# Altium schematic sheet IDC_MCX_Adapter_Front.SchDoc: IDC MCX adapter
size 420 x 297 mm; EDA_Number: ARTIQ; Projet: Fastino; Author: G.Kasprowicz; CompanyName: WUT ISE; DrawnBy: G.Kasprowicz; Organization: WUT ISE; Address1: PW ISE; Address2: Nowowiejska 15/19 00-665 Warsaw; Address3: gkasprow@gmail.com; DocumentNumber: 1; Revision: 2; SheetNumber: 1; SheetTotal: 3; ModifiedBy: -; CheckedDate: -; Title2: front panel; DivGrp: WUT ISE; Designer: G.Kasprowicz; ModifiedDate: -; ProjectName: Sensor Box
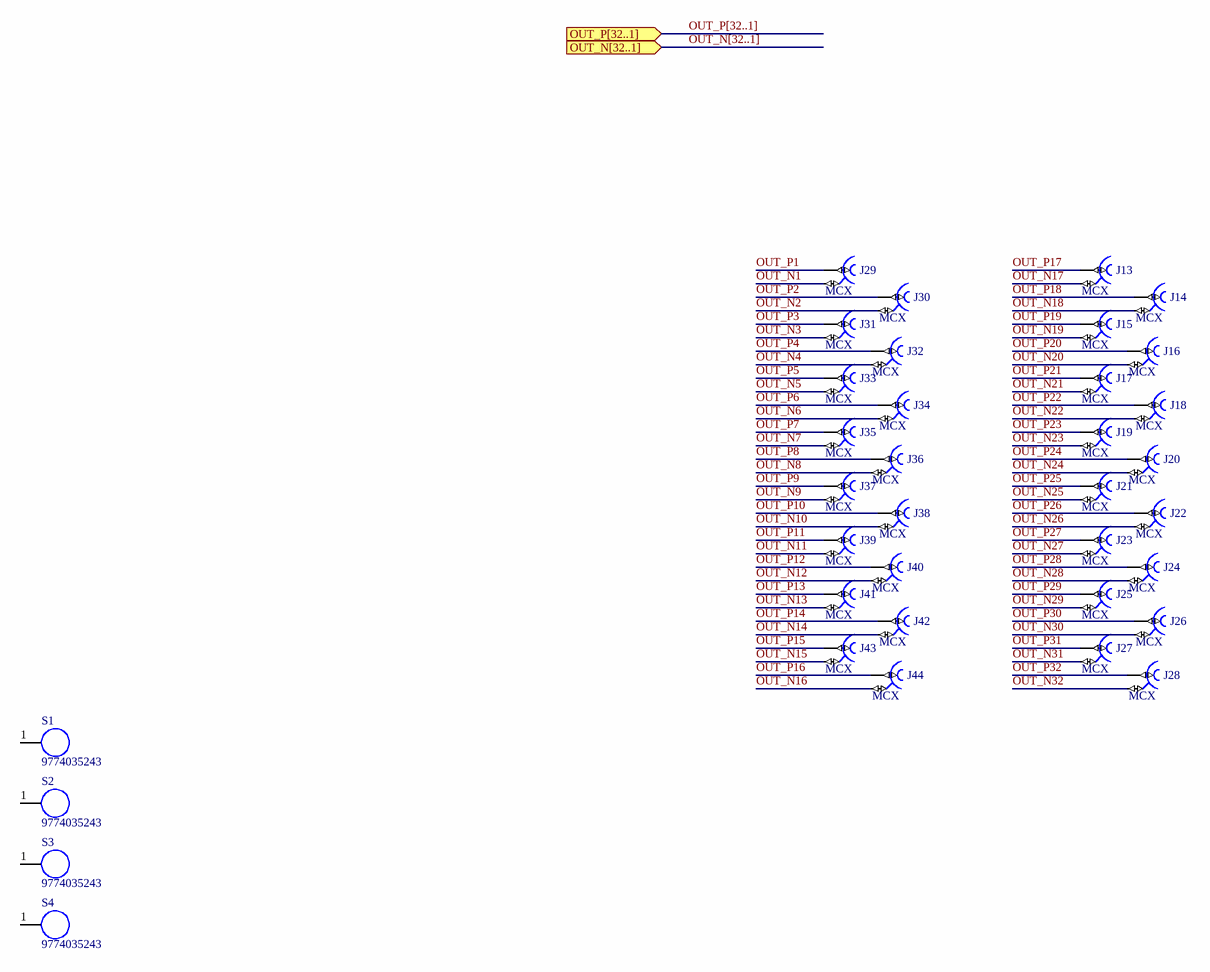
[diagram p0: IDC_MCX_Adapter_Front.SchDoc]

## Parts
J13  MCX  [AMPHENOL_919-109J-51PX]
J14  MCX  [AMPHENOL_919-109J-51PX]
J15  MCX  [AMPHENOL_919-109J-51PX]
J16  MCX  [AMPHENOL_919-109J-51PX]
J17  MCX  [AMPHENOL_919-109J-51PX]
J18  MCX  [AMPHENOL_919-109J-51PX]
J19  MCX  [AMPHENOL_919-109J-51PX]
J20  MCX  [AMPHENOL_919-109J-51PX]
J21  MCX  [AMPHENOL_919-109J-51PX]
J22  MCX  [AMPHENOL_919-109J-51PX]
J23  MCX  [AMPHENOL_919-109J-51PX]
J24  MCX  [AMPHENOL_919-109J-51PX]
J25  MCX  [AMPHENOL_919-109J-51PX]
J26  MCX  [AMPHENOL_919-109J-51PX]
J27  MCX  [AMPHENOL_919-109J-51PX]
J28  MCX  [AMPHENOL_919-109J-51PX]
J29  MCX  [AMPHENOL_919-109J-51PX]
J30  MCX  [AMPHENOL_919-109J-51PX]
J31  MCX  [AMPHENOL_919-109J-51PX]
J32  MCX  [AMPHENOL_919-109J-51PX]
J33  MCX  [AMPHENOL_919-109J-51PX]
J34  MCX  [AMPHENOL_919-109J-51PX]
J35  MCX  [AMPHENOL_919-109J-51PX]
J36  MCX  [AMPHENOL_919-109J-51PX]
J37  MCX  [AMPHENOL_919-109J-51PX]
J38  MCX  [AMPHENOL_919-109J-51PX]
J39  MCX  [AMPHENOL_919-109J-51PX]
J40  MCX  [AMPHENOL_919-109J-51PX]
J41  MCX  [AMPHENOL_919-109J-51PX]
J42  MCX  [AMPHENOL_919-109J-51PX]
J43  MCX  [AMPHENOL_919-109J-51PX]
J44  MCX  [AMPHENOL_919-109J-51PX]
S1  9774035243  [9774035243]
S2  9774035243  [9774035243]
S3  9774035243  [9774035243]
S4  9774035243  [9774035243]

## Ports
OUT_N[32..1] (in), OUT_P[32..1] (in)

## Nets
OUT_N1: J29.2
OUT_N2: J30.2
OUT_N3: J31.2
OUT_N4: J32.2
OUT_N5: J33.2
OUT_N6: J34.2
OUT_N7: J35.2
OUT_N8: J36.2
OUT_N9: J37.2
OUT_N10: J38.2
OUT_N11: J39.2
OUT_N12: J40.2
OUT_N13: J41.2
OUT_N14: J42.2
OUT_N15: J43.2
OUT_N16: J44.2
OUT_N17: J13.2
OUT_N18: J14.2
OUT_N19: J15.2
OUT_N20: J16.2
OUT_N21: J17.2
OUT_N22: J18.2
OUT_N23: J19.2
OUT_N24: J20.2
OUT_N25: J21.2
OUT_N26: J22.2
OUT_N27: J23.2
OUT_N28: J24.2
OUT_N29: J25.2
OUT_N30: J26.2
OUT_N31: J27.2
OUT_N32: J28.2
OUT_P1: J29.1
OUT_P2: J30.1
OUT_P3: J31.1
OUT_P4: J32.1
OUT_P5: J33.1
OUT_P6: J34.1
OUT_P7: J35.1
OUT_P8: J36.1
OUT_P9: J37.1
OUT_P10: J38.1
OUT_P11: J39.1
OUT_P12: J40.1
OUT_P13: J41.1
OUT_P14: J42.1
OUT_P15: J43.1
OUT_P16: J44.1
OUT_P17: J13.1
OUT_P18: J14.1
OUT_P19: J15.1
OUT_P20: J16.1
OUT_P21: J17.1
OUT_P22: J18.1
OUT_P23: J19.1
OUT_P24: J20.1
OUT_P25: J21.1
OUT_P26: J22.1
OUT_P27: J23.1
OUT_P28: J24.1
OUT_P29: J25.1
OUT_P30: J26.1
OUT_P31: J27.1
OUT_P32: J28.1

Not connected (* = marked no-connect by the designer): S1 1; S2 1; S3 1; S4 1

## Buses and harness runs
bus OUT_N[32..1] = port OUT_N[32..1]
bus OUT_P[32..1] = port OUT_P[32..1]

## Notes on the sheet
- Project/Equipment
- Document
- Designer
- Drawn by
- Check.by
- Copyright WUT ISE 2018.
  This documentation describes Open Hardware and is licensed under the CERN OHL v.1.1. You may redistribute and modify this documentation under the terms of the CERN OHL v.1.1. (http://ohwr.org/CERNOHL). This documentation is distributed WITHOUT ANY EXPRESS OR IMPLIED WARRANTY, INCLUDING OF MERCHANTABILITY, SATISFACTORY QUALITY AND FITNESS FOR A PARTICULAR PURPOSE. Please see the CERN OHL v.1.1 for applicable conditions.
- Contact
- File
- Last Mod.
- Print Date
- Sheet
- Size
- A3
- of
- Rev

## Library data of the parts
J13-J44 = AMPHENOL_919-109J-51PX: Part Description: 50 Ohm, RF Connector, MCX Straight PCB Receptacle Jack; Manufacturer Part Number: 919-109J-51PX (MCX6251B1-3GT30G-50); PressFit: No; Part Number: AMPHENOL_919-109J-51PX; Component Kind: Standard; Component Type: Standard; Pin Count: 5; Family: MCX; Mounted: Yes; Socket: No; SMD: No; Sense: No; Status: None; Manufacturer: AMPHENOL; ComponentHeight: 6.06mm; HelpURL: \\cern.ch\dfs\Applications\Altium\Datasheets\AMPHENOL_919-109J-51PX.pdf; Author: CERN DEM BC; CreateDate: 31.01.2019; LatestRevisionDate: 31.01.2019
S1-S4 = WA-SMSI,  9774035243: WA-SMSI SMD Steel Spacer with internal Thread; Manufacturer: Wurth Elektronik; partNo: 9774035243; ComponentLink1Description: Manufacturer; ComponentLink1URL: http://www.we-online.de; Created by: Baojun Chen; Created Date: 20.Oct.2015; ComponentLink2Description: Datasheet; ComponentLink2URL: http://katalog.we-online.de/em/datasheet/9774035243.pdf